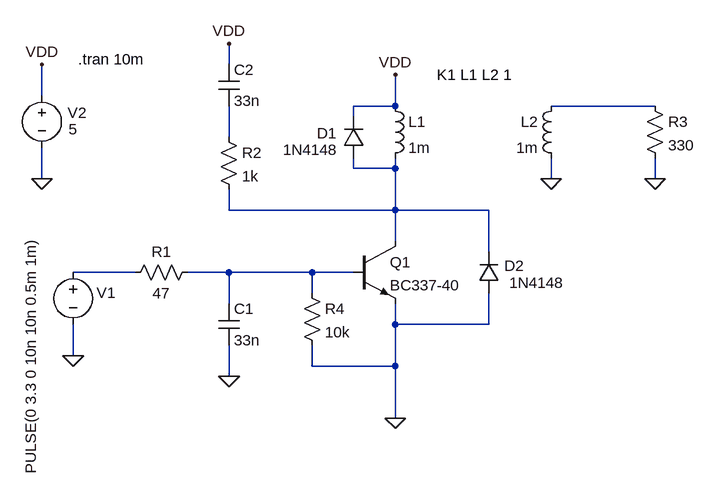
[diagram p0: schematic v2.0.asc]
v2.0.asc, the LTspice schematic file:
Version 4.1
SHEET 1 1028 772
WIRE 240 32 240 0
WIRE -48 80 -48 32
WIRE 496 96 496 48
WIRE 496 96 432 96
WIRE 896 96 736 96
WIRE 432 112 432 96
WIRE 240 144 240 96
WIRE 432 192 432 176
WIRE 496 192 496 176
WIRE 496 192 432 192
WIRE -48 208 -48 160
WIRE 736 208 736 176
WIRE 896 208 896 176
WIRE 240 256 240 224
WIRE 496 256 496 192
WIRE 496 256 240 256
WIRE 640 256 496 256
WIRE 496 304 496 256
WIRE 640 320 640 256
WIRE 96 352 0 352
WIRE 240 352 176 352
WIRE 368 352 240 352
WIRE 432 352 368 352
WIRE 368 384 368 352
WIRE 240 400 240 352
WIRE 496 432 496 400
WIRE 640 432 640 384
WIRE 640 432 496 432
WIRE 0 480 0 432
WIRE 368 496 368 464
WIRE 496 496 496 432
WIRE 496 496 368 496
WIRE 240 512 240 464
WIRE 496 576 496 496
FLAG 496 576 0
FLAG 736 208 0
FLAG 0 480 0
FLAG 896 208 0
FLAG -48 208 0
FLAG -48 32 VDD
FLAG 496 48 VDD
FLAG 240 0 VDD
FLAG 240 512 0
SYMBOL ind 480 80 R0
SYMATTR InstName L1
SYMATTR Value 1m
SYMATTR Type ind
SYMATTR SpiceLine Rser=6.3
SYMBOL ind 752 80 M0
SYMATTR InstName L2
SYMATTR Value 1m
SYMATTR Type ind
SYMATTR SpiceLine Rser=6.3
SYMBOL voltage 0 336 R0
WINDOW 0 36 47 Left 2
WINDOW 3 -65 -38 VRight 2
WINDOW 123 0 0 Left 0
WINDOW 39 0 0 Left 0
SYMATTR InstName V1
SYMATTR Value PULSE(0 3.3 0 10n 10n 0.5m 1m)
SYMBOL diode 448 176 R180
WINDOW 0 42 38 Left 2
WINDOW 3 40 13 Left 2
SYMATTR InstName D1
SYMATTR Value 1N4148
SYMBOL res 192 336 R90
WINDOW 0 0 56 VBottom 2
WINDOW 3 32 56 VTop 2
SYMATTR InstName R1
SYMATTR Value 47
SYMBOL cap 224 32 R0
SYMATTR InstName C2
SYMATTR Value 33n
SYMBOL res 224 128 R0
SYMATTR InstName R2
SYMATTR Value 1k
SYMBOL res 880 80 R0
SYMATTR InstName R3
SYMATTR Value 330
SYMBOL npn 432 304 R0
SYMATTR InstName Q1
SYMATTR Value BC337-40
SYMBOL voltage -48 64 R0
WINDOW 0 40 42 Left 2
WINDOW 3 41 68 Left 2
WINDOW 123 0 0 Left 0
WINDOW 39 0 0 Left 0
SYMATTR InstName V2
SYMATTR Value 5
SYMBOL diode 656 384 R180
WINDOW 0 -39 42 Left 2
WINDOW 3 -100 16 Left 2
SYMATTR InstName D2
SYMATTR Value 1N4148
SYMBOL res 352 368 R0
SYMATTR InstName R4
SYMATTR Value 10k
SYMBOL cap 224 400 R0
SYMATTR InstName C1
SYMATTR Value 33n
TEXT 560 48 Left 2 !K1 L1 L2 1
TEXT 8 24 Left 2 !.tran 10m

The netlist it stands for:
* v2.0.asc
L1 VDD N003 1m Rser=6.3
L2 N001 0 1m Rser=6.3
V1 N004 0 PULSE(0 3.3 0 10n 10n 0.5m 1m)
D1 N003 VDD 1N4148
R1 N005 N004 47
C2 VDD N002 33n
R2 N002 N003 1k
R3 N001 0 330
Q1 N003 N005 0 0 BC337-40
V2 VDD 0 5
D2 0 N003 1N4148
R4 N005 0 10k
C1 N005 0 33n
.model D D
.lib standard.dio
.model NPN NPN
.model PNP PNP
.lib standard.bjt
K1 L1 L2 1
.tran 10m
.backanno
.end